# EasyEDA schematic FYP_Programmer.json
TITLE: Critical_components; REV: 2.0; Date: 2023-10-12; Sheet: 1/3; Drawn By: MarynaCoetzer; Company: NWU
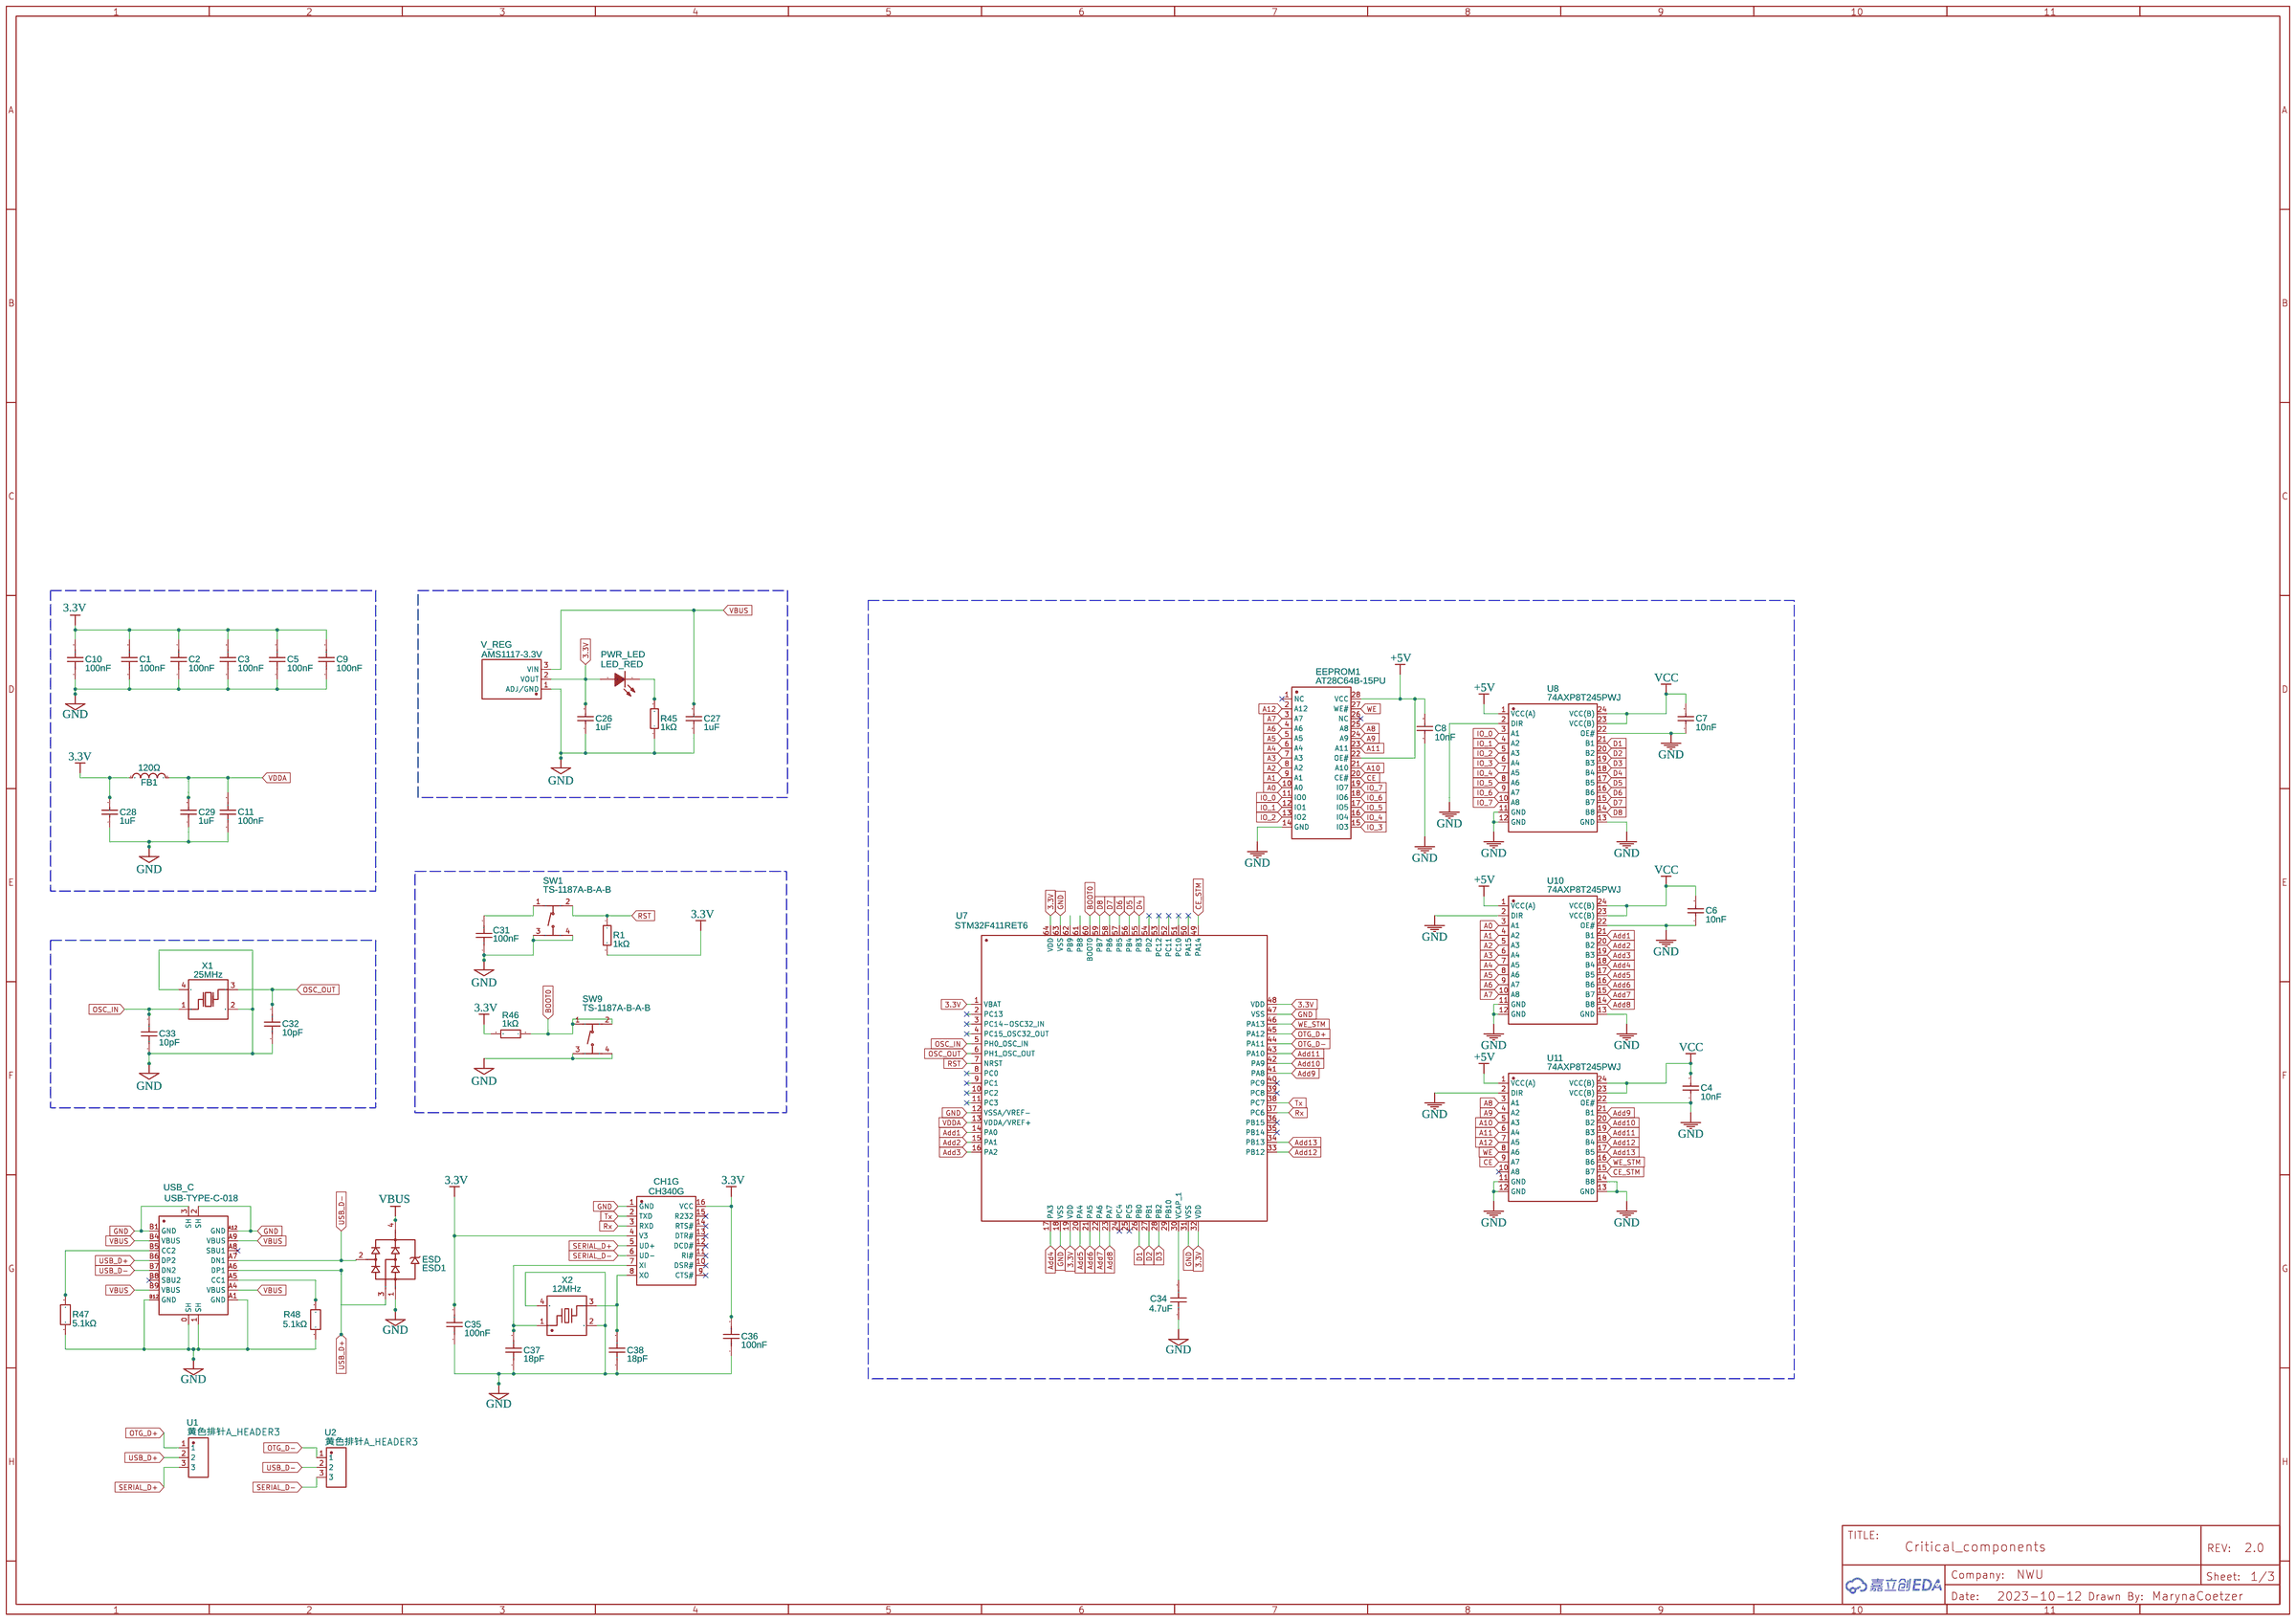
[diagram p0: schematic sheet]

## Parts
C1  100nF  [C0603]
C2  100nF  [C0603]
C3  100nF  [C0603]
C4  10nF  [C0603]
C5  100nF  [C0603]
C6  10nF  [C0603]
C7  10nF  [C0603]
C8  10nF  [C0603]
C9  100nF  [C0603]
C10  100nF  [C0603]
C11  100nF  [C0603]
C26  1uF  [C0603]
C27  1uF  [C0603]
C28  1uF  [C0603]
C29  1uF  [C0603]
C31  100nF  [C0603]
C32  10pF  [C0402]
C33  10pF  [C0402]
C34  4.7uF  [C0603]
C35  100nF  [C0603]
C36  100nF  [C0603]
C37  18pF  [C0603]
C38  18pF  [C0603]
CH1G  CH340G  [SOIC-16_L9.9-W3.9-P1.27-LS6.0-BL]
EEPROM1  AT28C64B-15PU  [DIP-28_L37.0-W13.8-P2.54-LS15.8-BL]
ESD  ESD1  [SOT-143_L2.9-W1.3-P1.92-LS2.3-BR]
FB1  120Ω  [L0603]
PWR_LED  LED_RED  [LED0805-RD_RED]
R1  1kΩ  [R0603]
R45  1kΩ  [R0603]
R46  1kΩ  [R0603]
R47  5.1kΩ  [R0603]
R48  5.1kΩ  [R0603]
SW1  TS-1187A-B-A-B  [SW-SMD_4P-L5.1-W5.1-P3.70-LS6.5-TL_H1.5]
SW9  TS-1187A-B-A-B  [SW-SMD_4P-L5.1-W5.1-P3.70-LS6.5-TL_H1.5]
U1  黄色排针A_HEADER3  [HDR-TH_3P-P2.54-V-M-1]
U2  黄色排针A_HEADER3  [HDR-TH_3P-P2.54-V-M-1]
U7  STM32F411RET6  [LQFP-64_L10.0-W10.0-P0.50-LS12.0-BL]
U8  74AXP8T245PWJ  [TSSOP-24_L7.8-W4.4-P0.65-LS6.4-BL]
U10  74AXP8T245PWJ  [TSSOP-24_L7.8-W4.4-P0.65-LS6.4-BL]
U11  74AXP8T245PWJ  [TSSOP-24_L7.8-W4.4-P0.65-LS6.4-BL]
USB_C  USB-TYPE-C-018  [USB-C_SMD-TYPE-C-31-M-12]
V_REG  AMS1117-3.3V  [SOT-89-3_L4.5-W2.5-P1.50-LS4.2-BR]
X1  25MHz  [CRYSTAL-SMD_4P-L3.2-W2.5-BL]
X2  12MHz  [CRYSTAL-SMD_4P-L3.2-W2.5-BL]

## Library data of the parts
C1-C3 C5 C9-C11 = CC0603KRX7R9BB104: Supplier: LCSC; Manufacturer: YAGEO(国巨); Supplier Part: C14663; JLCPCB Part Class: Basic Part
C4 C6-C8 = 0603B103K500NT: Supplier: LCSC; Manufacturer: FH(风华); Supplier Part: C57112; JLCPCB Part Class: Basic Part
C26-C29 = CL10A105KB8NNNC: Supplier: LCSC; Manufacturer: SAMSUNG(三星); Supplier Part: C15849; JLCPCB Part Class: Basic Part
C31 = C1608X7R104KFTS: Supplier: LCSC; Supplier Part: C335112; Manufacturer: DARFON(达方); Contributor: LCSC; JLCPCB Part Class: Extended Part
C32 C33 = GJM1555C1H100JB01D: Supplier: LCSC; Manufacturer: muRata(村田); Supplier Part: C85874; JLCPCB Part Class: Extended Part
C34 = GRM188R61C475KE11D: Supplier: LCSC; Manufacturer: muRata(村田); Supplier Part: C77045; JLCPCB Part Class: Extended Part
C35 C36 = 06033C104K4T2A: Contributor: LCSC; Supplier: LCSC; Supplier Part: C597114; Manufacturer: Kyocera AVX; JLCPCB Part Class: Extended Part
C37 C38 = AC0603JRNPO0BN220: Supplier: LCSC; Supplier Part: C2176438; Manufacturer: YAGEO(国巨); Capacitance: 22pF; JLCPCB Part Class: Extended Part; Contributor: lcsc
CH1G = CH340G: Supplier: LCSC; Manufacturer: WCH(南京沁恒); Supplier Part: C14267; JLCPCB Part Class: Extended Part
EEPROM1 = AT28C64B-15PU: Supplier: LCSC; Manufacturer: MICROCHIP(美国微芯); Supplier Part: C41982; JLCPCB Part Class: Extended Part
ESD = TPPRTR5V0U2X: Supplier: LCSC; Supplier Part: C558444; Manufacturer: TECH PUBLIC(台舟); Contributor: LCSC; JLCPCB Part Class: Extended Part
FB1 = GZ1608D121TF-C12391: Supplier: LCSC; Manufacturer: Sunlord(顺络); Manufacturer Part: GZ1608D121TF; Supplier Part: C12391; JLCPCB Part Class: Extended Part
PWR_LED = FC-2012HRK-620D: Supplier: LCSC; Manufacturer: 国星光电; Supplier Part: C84256; JLCPCB Part Class: Basic Part
R1 R46 = 0603WAF1001T5E: Supplier: LCSC; Manufacturer: UNI-ROYAL(厚声); Supplier Part: C21190; JLCPCB Part Class: Basic Part
R45 = RMS06FT1001: Supplier: LCSC; Supplier Part: C209012; Manufacturer: 大毅科技; Resistance (Ohms): 1K; Contributor: LCSC; JLCPCB Part Class: Extended Part
R47 R48 = CQ03WAJ0512T5E: Supplier: LCSC; Supplier Part: C473622; Manufacturer: UNI-ROYAL(厚声); Contributor: LCSC; JLCPCB Part Class: Extended Part
SW1 SW9 = TS-1187A-B-A-B: Contributor: LCSC; Supplier: LCSC; Supplier Part: C318884; Manufacturer: XKB Connection(中国星坤); JLCPCB Part Class: Basic Part
U1 U2 = 黄色排针A_HEADER3: Contributor: lcsc; Supplier: LCSC; Supplier Part: C9900019266; Manufacturer: null; JLCPCB Part Class: Extended Part
U7 = STM32F411RET6: Supplier: LCSC; Manufacturer: ST(意法半导体); Supplier Part: C94355; JLCPCB Part Class: Extended Part
U8 U10 U11 = 74AXP8T245PWJ: Contributor: LCSC; Supplier: LCSC; Supplier Part: C546420; Manufacturer: Nexperia(安世); JLCPCB Part Class: Extended Part
USB_C = USB-TYPE-C-018: Supplier: LCSC; Supplier Part: C2927038; Manufacturer: DEALON(德艺隆); Contributor: LCSC; JLCPCB Part Class: Extended Part
V_REG = AMS1117-3.3V_C5120796: Supplier: LCSC; Supplier Part: C5120796; Manufacturer: MSKSEMI(美森科); Contributor: lcsc; JLCPCB Part Class: Extended Part
X1 = X322525MMB4SI: Supplier: LCSC; Manufacturer: YXC(扬兴晶振); Supplier Part: C70582; JLCPCB Part Class: Extended Part
X2 = 7B012000Q01: Contributor: LCSC; Supplier: LCSC; Supplier Part: C654951; Manufacturer: HD(浩都频率); JLCPCB Part Class: Extended Part

## Nets
3.3V: C1.2 C2.2 C3.2 C5.2 C9.2 C10.2 C26.2 C28.2 C35.2 C36.2 CH1G.4(V3) CH1G.16(VCC) FB1.1 PWR_LED.2(+) R1.2 R46.2 U7.1(VBAT) U7.19(VDD) U7.32(VDD) U7.48(VDD) U7.64(VDD) V_REG.2(VOUT)
+5V: C8.2 EEPROM1.22(OE#) EEPROM1.28(VCC) U8.1(VCC(A)) U10.1(VCC(A)) U11.1(VCC(A))
GND: C1.1 C2.1 C3.1 C4.1 C5.1 C6.1 C7.1 C8.1 C9.1 C10.1 C11.1 C26.1 C27.1 C28.1 C29.1 C31.1 C32.2 C33.2 C34.1 C35.1 C36.1 C37.1 C38.1 CH1G.1(GND) EEPROM1.14(GND) ESD.1 R45.1 R47.1 R48.1 SW1.3(C) SW1.4(D) SW9.3(C) SW9.4(D) U7.12(VSSA/VREF-) U7.18(VSS) U7.31(VSS) U7.47(VSS) U7.63(VSS) U8.2(DIR) U8.11(GND) U8.12(GND) U8.13(GND) U8.22(OE#) U10.2(DIR) U10.11(GND) U10.12(GND) U10.13(GND) U10.22(OE#) U11.2(DIR) U11.11(GND) U11.12(GND) U11.13(GND) U11.14(B8) U11.22(OE#) USB_C.0(SH) USB_C.1(SH) USB_C.2(SH) USB_C.3(SH) USB_C.A1(GND) USB_C.A12(GND) USB_C.B1(GND) USB_C.B12(GND) V_REG.1(ADJ/GND) X1.2(GND) X1.4(GND) X2.2(GND) X2.4(GND)
VBUS: C27.2 ESD.4 USB_C.A4(VBUS) USB_C.A9(VBUS) USB_C.B4(VBUS) USB_C.B9(VBUS) V_REG.3(VIN)
VCC: C4.2 C6.2 C7.2 U8.23(VCC(B)) U8.24(VCC(B)) U10.23(VCC(B)) U10.24(VCC(B)) U11.23(VCC(B)) U11.24(VCC(B))
VDDA: C11.2 C29.2 FB1.2 U7.13(VDDA/VREF+)
A0: EEPROM1.10(A0) U10.3(A1)
A1: EEPROM1.9(A1) U10.4(A2)
A2: EEPROM1.8(A2) U10.5(A3)
A3: EEPROM1.7(A3) U10.6(A4)
A4: EEPROM1.6(A4) U10.7(A5)
A5: EEPROM1.5(A5) U10.8(A6)
A6: EEPROM1.4(A6) U10.9(A7)
A7: EEPROM1.3(A7) U10.10(A8)
A8: EEPROM1.25(A8) U11.3(A1)
A9: EEPROM1.24(A9) U11.4(A2)
A10: EEPROM1.21(A10) U11.5(A3)
A11: EEPROM1.23(A11) U11.6(A4)
A12: EEPROM1.2(A12) U11.7(A5)
Add1: U7.14(PA0) U10.21(B1)
Add2: U7.15(PA1) U10.20(B2)
Add3: U7.16(PA2) U10.19(B3)
Add4: U7.17(PA3) U10.18(B4)
Add5: U7.20(PA4) U10.17(B5)
Add6: U7.21(PA5) U10.16(B6)
Add7: U7.22(PA6) U10.15(B7)
Add8: U7.23(PA7) U10.14(B8)
Add9: U7.41(PA8) U11.21(B1)
Add10: U7.42(PA9) U11.20(B2)
Add11: U7.43(PA10) U11.19(B3)
Add12: U7.33(PB12) U11.18(B4)
Add13: U7.34(PB13) U11.17(B5)
BOOT0: R46.1 SW9.1(A) SW9.2(B) U7.60(BOOT0)
CE: EEPROM1.20(CE#) U11.9(A7)
CE_STM: U7.49(PA14) U11.15(B7)
D1: U7.26(PB0) U8.21(B1)
D2: U7.27(PB1) U8.20(B2)
D3: U7.28(PB2) U8.19(B3)
D4: U7.55(PB3) U8.18(B4)
D5: U7.56(PB4) U8.17(B5)
D6: U7.57(PB5) U8.16(B6)
D7: U7.58(PB6) U8.15(B7)
D8: U7.59(PB7) U8.14(B8)
IO_0: EEPROM1.11(IO0) U8.3(A1)
IO_1: EEPROM1.12(IO1) U8.4(A2)
IO_2: EEPROM1.13(IO2) U8.5(A3)
IO_3: EEPROM1.15(IO3) U8.6(A4)
IO_4: EEPROM1.16(IO4) U8.7(A5)
IO_5: EEPROM1.17(IO5) U8.8(A6)
IO_6: EEPROM1.18(IO6) U8.9(A7)
IO_7: EEPROM1.19(IO7) U8.10(A8)
OSC_IN: C33.1 U7.5(PH0_OSC_IN) X1.1(OSC1)
OSC_OUT: C32.1 U7.6(PH1_OSC_OUT) X1.3(OSC2)
OTG_D+: U1.1 U7.45(PA12)
OTG_D-: U2.1 U7.44(PA11)
RST: R1.1 SW1.2(B) U7.7(NRST)
Rx: CH1G.3(RXD) U7.37(PC6)
SERIAL_D+: CH1G.5(UD+) U1.3
SERIAL_D-: CH1G.6(UD-) U2.3
Tx: CH1G.2(TXD) U7.38(PC7)
USB_D+: ESD.3 U1.2 USB_C.A6(DP1) USB_C.B6(DP2)
USB_D-: ESD.2 U2.2 USB_C.A7(DN1) USB_C.B7(DN2)
WE: EEPROM1.27(WE#) U11.8(A6)
WE_STM: U7.46(PA13) U11.16(B6)
Net-(C31-2): C31.2 SW1.1(A)
Net-(C34-2): C34.2 U7.30(VCAP_1)
Net-(C37-2): C37.2 CH1G.7(XI) X2.1
Net-(C38-2): C38.2 CH1G.8(XO) X2.3
Net-(PWR_LED-1): PWR_LED.1(-) R45.2
Net-(R47-2): R47.2 USB_C.B5(CC2)
Net-(R48-2): R48.2 USB_C.A5(CC1)

Not connected (* = marked no-connect by the designer): CH1G 9(CTS#)* 10(DSR#)* 11(RI#)* 12(DCD#)* 13(DTR#)* 14(RTS#)* 15(R232)*; EEPROM1 1(NC)* 26(NC)*; U7 2(PC13) 3(PC14-OSC32_IN) 4(PC15_OSC32_OUT) 8(PC0) 9(PC1) 10(PC2) 11(PC3) 24(PC4)* 25(PC5)* 29(PB10) 35(PB14)* 36(PB15)* 39(PC8)* 40(PC9)* 50(PA15) 51(PC10) 52(PC11) 53(PC12) 54(PD2) 61(PB8) 62(PB9); U11 10(A8)*; USB_C A8(SBU1)* B8(SBU2)*
